# Altium schematic sheet Sheet2.SchDoc
size A; SheetNumber: 1; SheetTotal: 1
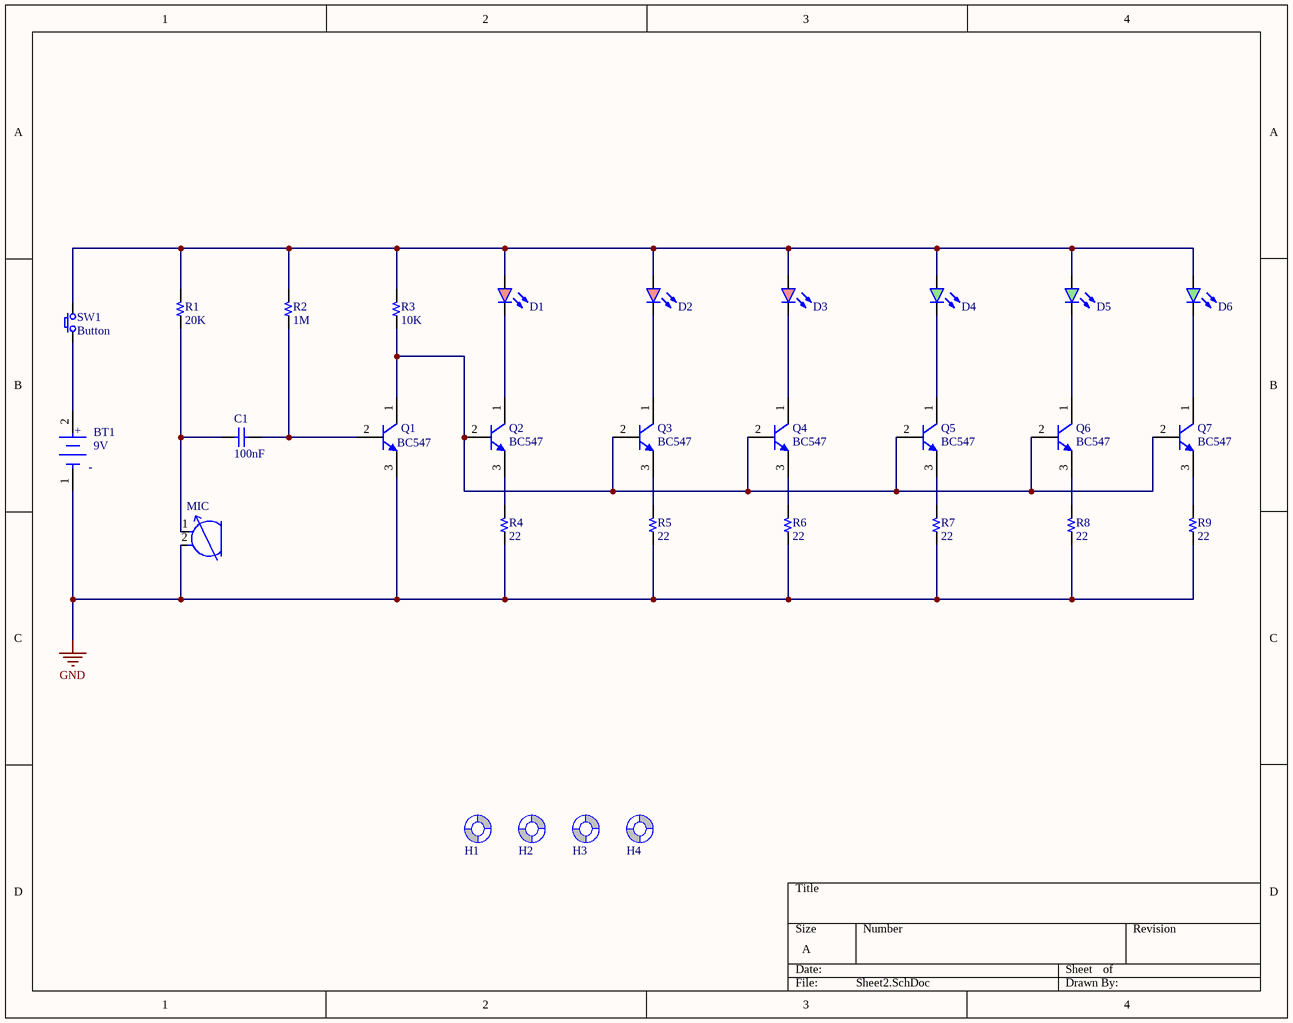
[diagram p0: Sheet2.SchDoc]

## Parts
BT1  9V  [FP-BH9VPC-MFG]
C1  100nF  [CAP Ceramic/W300]
D1  LED RED  [LED 10MM - RED]  (value not drawn)
D2  LED RED  [LED 10MM - RED]  (value not drawn)
D3  LED RED  [LED 10MM - RED]  (value not drawn)
D4  LED GREEN  [LED 10MM - GREEN]  (value not drawn)
D5  LED GREEN  [LED 10MM - GREEN]  (value not drawn)
D6  LED GREEN  [LED 10MM - GREEN]  (value not drawn)
H1  Screw Hole  [SCREW/3.2/7.0/M]  (value not drawn)  (no BOM)
H2  Screw Hole  [SCREW/3.2/7.0/M]  (value not drawn)  (no BOM)
H3  Screw Hole  [SCREW/3.2/7.0/M]  (value not drawn)  (no BOM)
H4  Screw Hole  [SCREW/3.2/7.0/M]  (value not drawn)  (no BOM)
MIC  POM-3535P-3-R  [FP-POM-3535P-3-R-MFG]  (value not drawn)
Q1  BC547  [ONSC-TO-92-3-29-11_AM_BL]
Q2  BC547  [ONSC-TO-92-3-29-11_AM_BL]
Q3  BC547  [ONSC-TO-92-3-29-11_AM_BL]
Q4  BC547  [ONSC-TO-92-3-29-11_AM_BL]
Q5  BC547  [ONSC-TO-92-3-29-11_AM_BL]
Q6  BC547  [ONSC-TO-92-3-29-11_AM_BL]
Q7  BC547  [ONSC-TO-92-3-29-11_AM_BL]
R1  20K  [R 1/4W/300]
R2  1M  [R 1/4W/300]
R3  10K  [R 1/4W/300]
R4  22  [R 1/4W/300]
R5  22  [R 1/4W/300]
R6  22  [R 1/4W/300]
R7  22  [R 1/4W/300]
R8  22  [R 1/4W/300]
R9  22  [R 1/4W/300]
SW1  Button  [SW/2/DIP]

## Nets
GND: BT1.1(C) MIC.2(C) Q1.3(E) R4.1 R5.1 R6.1 R7.1 R8.1 R9.1
NetBT1_2: BT1.2(A) SW1.1
NetC1_1: C1.1 MIC.1(A) R1.1
NetC1_2: C1.2 Q1.2(B) R2.1
NetD1_1: D1.1(A) D2.1(A) D3.1(A) D4.1(A) D5.1(A) D6.1(A) R1.2 R2.2 R3.2 SW1.2
NetD1_2: D1.2(K) Q2.1(C)
NetD2_2: D2.2(K) Q3.1(C)
NetD3_2: D3.2(K) Q4.1(C)
NetD4_2: D4.2(K) Q5.1(C)
NetD5_2: D5.2(K) Q6.1(C)
NetD6_2: D6.2(K) Q7.1(C)
NetQ1_1: Q1.1(C) Q2.2(B) Q3.2(B) Q4.2(B) Q5.2(B) Q6.2(B) Q7.2(B) R3.1
NetQ2_3: Q2.3(E) R4.2
NetQ3_3: Q3.3(E) R5.2
NetQ4_3: Q4.3(E) R6.2
NetQ5_3: Q5.3(E) R7.2
NetQ6_3: Q6.3(E) R8.2
NetQ7_3: Q7.3(E) R9.2

Not connected (* = marked no-connect by the designer): H1 1(Screw); H2 1(Screw); H3 1(Screw); H4 1(Screw)

## Notes on the sheet
- (in symbol CMP-136216-000001-1) +; -

## Library data of the parts
BT1 = CMP-136216-000001-1: BATTERY HOLDER 9V PC PIN; Manufacturer Part Number: BH9VPC; Manufacturer: Memory Protection Devices; Conn Orientation: Vertical; Is Female: yes; Number Of Contacts: 2; Device Class L2: unset; Contact Material: Nickel; Device Class L1: Connectors; Lead Free: Yes; Digikey Description: BATTERY HOLDER 9V PC PIN; Category: Batt; ComponentLink2URL: http://www.memoryprotectiondevices.com/datasheets/BH9VPC-datasheet.pdf; Device Class L3: unset; Package: 0; Automotive: No; ComponentLink2Description: Datasheet; Height: 21.12mm; Voltage Rating: 9V; Octopart: https://octopart.com/bh9vpc-memory+protection+devices-22788154; RoHS: TRUE
C1 = Capacitor NP: Capacitor non-pol
D1-D3 = LED RED: Typical LED 3-pin 2-color
D4-D6 = LED GREEN: Typical LED 3-pin 2-color
MIC = CMP-231723-000001-1: MIC COND ANALOG OMNI -35DB 6MM D; Resistance: 2200R; Direction: Omnidirectional; Impedance: 2.2kR; Shape: Round; Voltage Rating: 2V; Operating Supply Current: 500uA; Packaging: Bulk; Height: 3.7mm; Termination: PC Pins; Depth: 3.7mm; Diameter: 6mm; Mount: Through Hole; Package Quantity: 100; Output Type: Analog
Q1-Q7 = CMP-1048-01605-1: Amplifier Transistor, NPN Silicon, 3-Pin TO-92, Pb-Free, Tape and Reel; Manufacturer: On Semiconductor; PartNumber: BC547BRL1G; IC Continuous (A): 0.1; fT Min (MHz): 150; ComponentLink2URL: http://www.onsemi.com/pub_link/Collateral/BC546-D.PDF; ComponentLink1URL: http://www.onsemi.com/; ComponentLink2Description: Datasheet; RoHS: TRUE; ComponentLink3Description: Package Specification; ComponentLink1Description: Manufacturer URL; ComponentLink3URL: http://www.onsemi.com/pub_link/Collateral/MAC97-D.PDF; PackageDescription: 3-Pin Transistor Outline, Body 4.825 x 3.685 mm, Pitch 1.27 mm; Packing: Tape and Reel; PackageVersion: Rev. AM; Polarity: NPN; DatasheetVersion: Rev. 7; Mounting Technology: Through Hole; PackageReference: TO-92-3-29-11_AM_BL
R1-R9 = Resistor
SW1 = SW SPST: Tact switch 2 pin
H1-H4 = Screw Hole: TYPE: NO-BOM; UNIT PRICE: 0